# EAGLE design Arduino_bt07 (EAGLE 6.4)
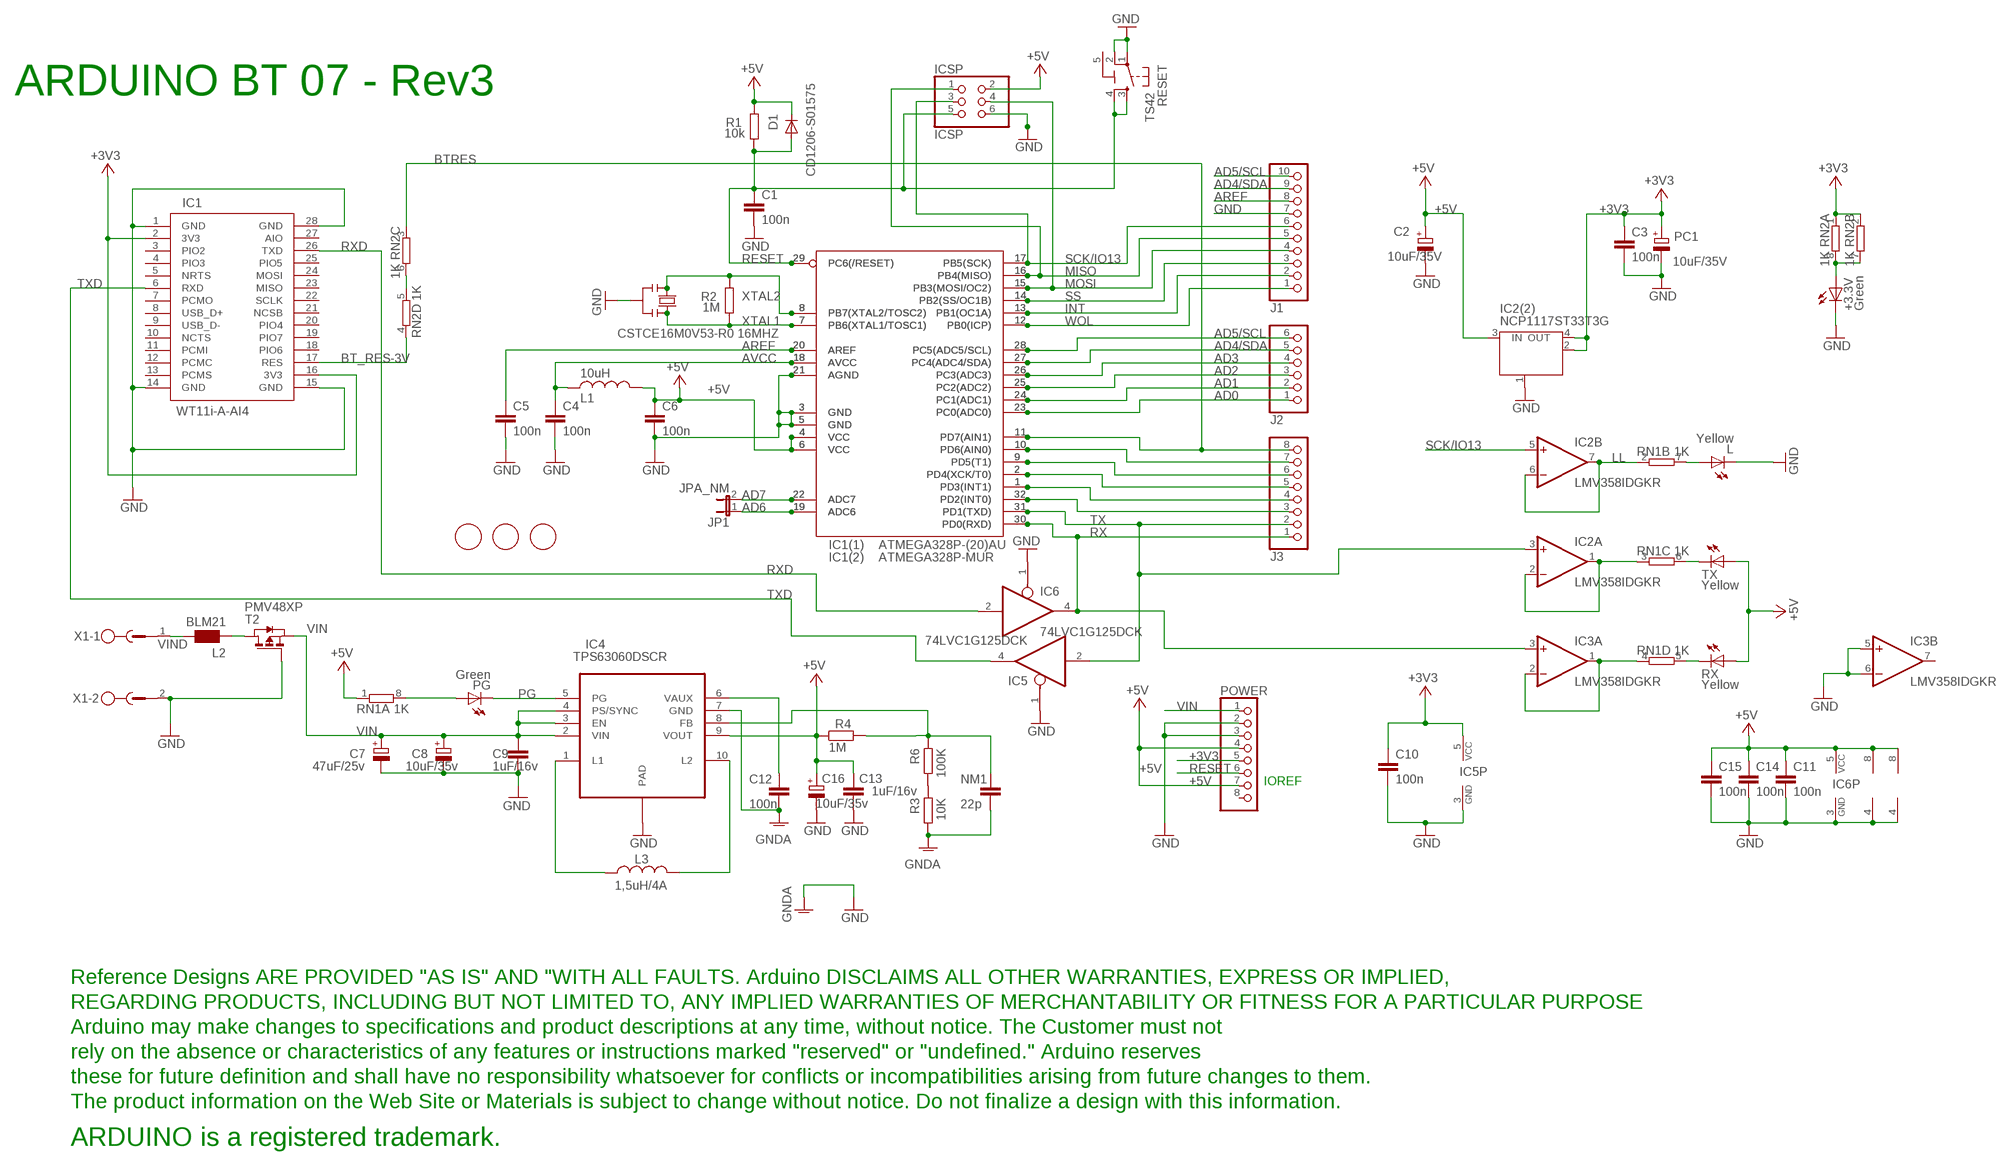
[diagram p0: schematic, sheet 1]

## Parts
+3.3V  Green  LEDCHIPLED_0805  [CHIPLED_0805]
C1  100n  C-EU0603-RND  [C0603-ROUND]
C2  10uF/35V  CPOL-EUSMCB  [SMC_B]
C3  100n  C-EU0603-RND  [C0603-ROUND]
C4  100n  C-EU0603-RND  [C0603-ROUND]
C5  100n  C-EU0603-RND  [C0603-ROUND]
C6  100n  C-EU0603-RND  [C0603-ROUND]
C7  47uF/25v  CPOL-EUD  [PANASONIC_D]
C8  10uF/35v  CPOL-EUSMCB  [SMC_B]
C9  1uF/16v  C-EUC0603  [C0603-ROUND]
C10  100n  C-EU0603-RND  [C0603-ROUND]
C11  100n  C-EU0603-RND  [C0603-ROUND]
C12  100n  C-EUC0603  [C0603-ROUND]
C13  1uF/16v  C-EUC0603  [C0603-ROUND]
C14  100n  C-EU0603-RND  [C0603-ROUND]
C15  100n  C-EU0603-RND  [C0603-ROUND]
C16  10uF/35v  CPOL-EUSMCB  [SMC_B]
D1  CD1206-S01575  DIODE-MINIMELF  [MINIMELF]
IC1  WT11i-A-AI4  WT11  [WT11-A]
IC1(1)  ATMEGA328P-(20)AU  ATMEGAXX8-AU  [TQFP32-08]
IC1(2)  ATMEGA328P-MUR  ATMEGAXX8-MUR  [MLF32]
IC2  LMV358IDGKR  LMV358MM  [MSOP08]
IC2(2)  NCP1117ST33T3G  MC33269ST-3.3T3  [SOT223]
IC3  LMV358IDGKR  LMV358MM  [MSOP08]
IC4  TPS63060DSCR  TPS63060  [R-PVSON-10N]
IC5  74LVC1G125DCK  [SC70-5]
IC6  74LVC1G125DCK  [SC70-5]
ICSP  ICSP  PINHD-2X3  [2X03]
J1  PINHD-1X10TH  [1X10-TH]
J2  PINHD-1X6TH  [1X06-TH]
J3  PINHD-1X8TH  [1X08-TH]
JP1  JPA_NM  JP1E  [JP1]
L  Yellow  LEDCHIPLED_0805  [CHIPLED_0805]
L1  10uH  L-USL2012C  [L2012C]
L2  BLM21  WE-CBF_0805  [0805]
L3  1,5uH/4A  L-USSRR0604  [SRR0604]
NM1  22p  C-EUC0603  [C0603-ROUND]
PC1  10uF/35V  CPOL-EUSMCB  [SMC_B]
PG  Green  LEDCHIPLED_0805  [CHIPLED_0805]
POWER  PINHD-1X8TH  [1X08-TH]
R1  10k  R-EU_0603-RND  [R0603-ROUND]
R2  1M  R-EU_0603-RND  [R0603-ROUND]
R3  10K  R-EU_0603-RND  [R0603-ROUND]
R4  1M  R-EU_0603-RND  [R0603-ROUND]
R6  100K  R-EU_0603-RND  [R0603-ROUND]
RESET  TS42  [TS42]
RN1  1K  4R-NCAY16  [CAY16]
RN2  1K  4R-NCAY16  [CAY16]
RX  Yellow  LEDCHIPLED_0805  [CHIPLED_0805]
T2  PMV48XP  PMOSSOT23  [SOT-23]
TX  Yellow  LEDCHIPLED_0805  [CHIPLED_0805]
U$1  FIDUCIALMOUNT  [FIDUCIA-MOUNT]
U$2  FIDUCIALMOUNT  [FIDUCIA-MOUNT]
U$3  FIDUCIALMOUNT  [FIDUCIA-MOUNT]
U$4  DISCLAIMER  [DISCLAIMER]
X1  MSTBV2  [MSTBV2]
Y1  CSTCE16M0V53-R0 16MHZ  RESONATORMU  [RESONATOR]

## Nets
+3V3 [power]: C3.1 C10.1 IC1.2(3V3) IC1.16(3V3) IC2(2).2(OUT) IC2(2).4(OUT) IC5.5(VCC) PC1.+ POWER.5 RN2.1 RN2.2
+5V [power]: C2.+ C6.1 C11.1 C13.1 C14.1 C15.1 C16.+ D1.C IC1(1).4(VCC) IC1(1).6(VCC) IC1(2).4(VCC) IC1(2).6(VCC) IC2(2).3(IN) IC2.8(P:V+) IC3.8(P:V+) IC4.9(VOUT) IC6.5(VCC) ICSP.2 L1.1 POWER.4 POWER.7 R1.2 R4.1 RN1.1 RX.A TX.A
AD0: IC1(1).23(PC0(ADC0)) IC1(2).23(PC0(ADC0)) J2.1
AD1: IC1(1).24(PC1(ADC1)) IC1(2).24(PC1(ADC1)) J2.2
AD2: IC1(1).25(PC2(ADC2)) IC1(2).25(PC2(ADC2)) J2.3
AD3: IC1(1).26(PC3(ADC3)) IC1(2).26(PC3(ADC3)) J2.4
AD4/SDA: IC1(1).27(PC4(ADC4/SDA)) IC1(2).27(PC4(ADC4/SDA)) J1.9 J2.5
AD5/SCL: IC1(1).28(PC5(ADC5/SCL)) IC1(2).28(PC5(ADC5/SCL)) J1.10 J2.6
AD6: IC1(1).19(ADC6) IC1(2).19(ADC6) JP1.1
AD7: IC1(1).22(ADC7) IC1(2).22(ADC7) JP1.2
AREF [power]: C5.1 IC1(1).20(AREF) IC1(2).20(AREF) J1.8
AVCC [power]: C4.1 IC1(1).18(AVCC) IC1(2).18(AVCC) L1.2
BT_RES-3V: IC1.17(RES) RN2.4
BTRES: IC1(1).11(PD7(AIN1)) IC1(2).11(PD7(AIN1)) J3.8 RN2.3
GND [gnd]: +3.3V.C C1.2 C2.- C3.2 C4.2 C5.2 C6.2 C7.- C8.- C9.2 C10.2 C11.2 C13.2 C14.2 C15.2 C16.- IC1(1).3(GND) IC1(1).5(GND) IC1(1).21(AGND) IC1(2).3(GND) IC1(2).5(GND) IC1(2).21(AGND) IC1.1(GND) IC1.14(GND) IC1.15(GND) IC1.28(GND) IC2(2).1(GND/ADJ) IC2.4(P:V-) IC3.4(P:V-) IC3.5(B:+IN) IC3.6(B:-IN) IC4.PAD IC5.1(OE) IC5.3(GND) IC6.1(OE) IC6.3(GND) ICSP.6 J1.7 L.C PC1.- POWER.2 POWER.3 RESET.1 RESET.2 T2.3(G) X1.2 Y1.2
GNDA [gnd]: C12.2 IC4.7(GND) NM1.2 R3.2 ; supply symbol labelled GND
INT: IC1(1).13(PB1(OC1A)) IC1(2).13(PB1(OC1A)) J1.2
LL: IC2.6(B:-IN) IC2.7(B:OUT) RN1.2
MISO: IC1(1).16(PB4(MISO)) IC1(2).16(PB4(MISO)) ICSP.1 J1.5
MOSI: IC1(1).15(PB3(MOSI/OC2)) IC1(2).15(PB3(MOSI/OC2)) ICSP.4 J1.4
N$1: R3.1 R6.2
N$2: L.A RN1.7
N$3: RN1.6 TX.C
N$4: RN1.5 RX.C
N$5: +3.3V.A RN2.7 RN2.8
N$6: IC2.1(A:OUT) IC2.2(A:-IN) RN1.3
N$7: PG.A RN1.8
N$8: IC3.1(A:OUT) IC3.2(A:-IN) RN1.4
N$9: L2.1 T2.1(D)
N$11: IC1(1).1(PD3(INT1)) IC1(2).1(PD3(INT1)) J3.4
N$12: IC1(1).2(PD4(XCK/T0)) IC1(2).2(PD4(XCK/T0)) J3.5
N$13: IC1(1).9(PD5(T1)) IC1(2).9(PD5(T1)) J3.6
N$14: IC1(1).10(PD6(AIN0)) IC1(2).10(PD6(AIN0)) J3.7
N$15: IC4.10(L2) L3.P$2
N$16: RN2.5 RN2.6
N$17: IC1(1).32(PD2(INT0)) IC1(2).32(PD2(INT0)) J3.3
N$35: C12.1 IC4.6(VAUX)
N$39: IC4.8(FB) NM1.1 R4.2 R6.1
N$47: IC4.1(L1) L3.P$1
PG [power]: IC4.5(PG) PG.C
RESET: C1.1 D1.A IC1(1).29(PC6(/RESET)) IC1(2).29(PC6(/RESET)) ICSP.5 POWER.6 R1.1 RESET.3 RESET.4
RX: IC1(1).30(PD0(RXD)) IC1(2).30(PD0(RXD)) IC3.3(A:+IN) IC6.4(O) J3.1
RXD: IC1.26(TXD) IC6.2(I)
SCK/IO13: IC1(1).17(PB5(SCK)) IC1(2).17(PB5(SCK)) IC2.5(B:+IN) ICSP.3 J1.6
SS: IC1(1).14(PB2(SS/OC1B)) IC1(2).14(PB2(SS/OC1B)) J1.3
TX: IC1(1).31(PD1(TXD)) IC1(2).31(PD1(TXD)) IC2.3(A:+IN) IC5.2(I) J3.2
TXD: IC1.6(RXD) IC5.4(O)
VIN [power]: C7.+ C8.+ C9.1 IC4.2(VIN) IC4.3(EN) IC4.4(PS/SYNC) POWER.1 T2.2(S)
VIND [power]: L2.2 X1.1
WOL: IC1(1).12(PB0(ICP)) IC1(2).12(PB0(ICP)) J1.1
XTAL1: IC1(1).7(PB6(XTAL1/TOSC1)) IC1(2).7(PB6(XTAL1/TOSC1)) R2.1 Y1.3
XTAL2: IC1(1).8(PB7(XTAL2/TOSC2)) IC1(2).8(PB7(XTAL2/TOSC2)) R2.2 Y1.1
Unconnected: IC1.3(PIO2) IC1.4(PIO3) IC1.5(NRTS) IC1.7(PCMO) IC1.8(USB_D+) IC1.9(USB_D-) IC1.10(NCTS) IC1.11(PCMI) IC1.12(PCMC) IC1.13(PCMS) IC1.18(PIO6) IC1.19(PIO7) IC1.20(PIO4) IC1.21(NCSB) IC1.22(SCLK) IC1.23(MISO) IC1.24(MOSI) IC1.25(PIO5) IC1.27(AIO) IC3.7(B:OUT) POWER.8

## Notes on the sheet
- ARDUINO BT 07 - Rev3
- IOREF

## Power pins joined to a net without a drawn wire
5-GND: RESET.5(5-GND)

## Library data of the parts
+3.3V L PG RX TX = led:LED: LED OSRAM: - CHIPLED LG R971, LG N971, LY N971, LG Q971, LY Q971, LO R971, LY R971 LH N974, LH R974 LS Q976, LO Q976, LY Q976 LO Q996 - Hyper CHIPLED LW Q18S LB Q993, LB Q99A, LB R99A - SideLED LS A670, LO A670, LY A670, LG A670, LP A670 LB A673, LV A673, LT A673, LW A673 LH A674 LY A675 LS A676, LA A676, LO A676, LY A676, LW A676 LS A679, LY A679, LG A679 - Hyper Micro SIDELED® LS Y876, LA Y876, LO Y876, LY Y876 LT Y87S - SmartLED LW L88C, LW L88S LB L89C, LB L89S, LG L890 LS L89K, LO L89K, LY L89K LS L896, LA L896, LO L896, LY L896 - TOPLED LS T670, LO T670, LY T670, LG T670, LP T670 LSG T670, LSP T670, LSY T670, LOP T670, LYG T670 LG T671, LOG T671, LSG T671 LB T673, LV T673, LT T673, LW T673 LH T674 LS T676, LA T676, LO T676, LY T676, LB T676, LH T676, LSB T676, LW T676 LB T67C, LV T67C, LT T67C, LS T67K, LO T67K, LY T67K, LW E67C LS E67B, LA E67B, LO E67B, LY E67B, LB E67C, LV E67C, LT E67C LW T67C LS T679, LY T679, LG T679 LS T770, LO T770, LY T770, LG T770, LP T770 LB T773, LV T773, LT T773, LW T773 LH T774 LS E675, LA E675, LY E675, LS T675 LS T776, LA T776, LO T776, LY T776, LB T776 LHGB T686 LT T68C, LB T68C - Hyper Mini TOPLED® LB M676 - Mini TOPLED Santana® LG M470 LS M47K, LO M47K, LY M47K Source: http://www.osram.convergy.de - LUMILED® LXK2-PW12-R00, LXK2-PW12-S00, LXK2-PW14-U00, LXK2-PW14-V00 LXK2-PM12-R00, LXK2-PM12-S00, LXK2-PM14-U00 LXK2-PE12-Q00, LXK2-PE12-R00, LXK2-PE12-S00, LXK2-PE14-T00, LXK2-PE14-U00 LXK2-PB12-K00, LXK2-PB12-L00, LXK2-PB12-M00, LXK2-PB14-N00, LXK2-PB14-P00, LXK2-PB14-Q00 LXK2-PR12-L00, LXK2-PR12-M00, LXK2-PR14-Q00, LXK2-PR14-R00 LXK2-PD12-Q00, LXK2-PD12-R00, LXK2-PD12-S00 LXK2-PH12-R00, LXK2-PH12-S00 LXK2-PL12-P00, LXK2-PL12-Q00, LXK2-PL12-R00 Source: www.luxeon.com
C1 C3-C6 C9-C15 NM1 = SmartPrj:C-EU: CAPACITOR, European symbol
C2 C7 C8 C16 = SmartPrj:CPOL-EU: POLARIZED CAPACITOR, European symbol
D1 = diode:DIODE-: DIODE
IC1 = idii:WT11
IC1(1) IC1(2) = SmartPrj:ATMEGAXX8: MICROCONTROLLER 8 Kbytes FLASH 1 kbytes SRAM 512 bytes EEPROM USART 6-channel 10 bit ADC 2-channel 8 bit ADC Source: avr.lbr
IC2 IC3 = linear:LMV358?*: Dual General Purpose, Low Voltage, Rail-to-Rail Output Operational Amplifiers Source: http://www.national.com/mpf/LM/LMV321.html http://www.national.com/dt/lmv_qual.pdf
IC2(2) = linear:MC33269ST*: Adjustable Output Low Dropout Voltage Regulator 800 mA Source: http://www.onsemi.com/pub/Collateral/MC33269-D.PDF
IC4 = SmartPrj:TPS63060: TPS63060 Single Inductor Buck-Boost Converter 2A Switches
IC5 IC6 = 74xx-little-us:74*1G125: Single Bus Buffer Gate with 3-State Output
ICSP = SmartPrj:PINHD-2X3: PIN HEADER
J1 = SmartPrj:PINHD-1X10: PIN HEADER
J2 = SmartPrj:PINHD-1X6: PIN HEADER
J3 POWER = SmartPrj:PINHD-1X8: PIN HEADER
JP1 = jumper:JP1E: JUMPER
L1 L3 = SmartPrj:L-US: INDUCTOR, American symbol
L2 = wuerth-elektronik:WE-CBF: SMD EMI Suppression Ferrite Beads - excellent anti-EMI properties - low DCR - impedances till 3000 ohms - rated current up to 6 A
PC1 = rcl:CPOL-EU: POLARIZED CAPACITOR, European symbol
R1-R4 R6 = SmartPrj:R-EU_: RESISTOR, European symbol
RESET = SmartPrj:TS42: TS42 Dongnan Electronics Tact switch VDC 12V - 50mA
RN1 RN2 = resistor-dil:4R-N: Array Chip Resistor Source: RS Component / Phycomp
T2 = zetex:PMOSSOT23: MOS FET
U$1-U$3 = SmartPrj:FIDUCIALMOUNT
U$4 = SmartPrj:DISCLAIMER
X1 = con-phoenix-500:MSTBV2: PHOENIX
Y1 = SmartPrj:RESONATOR

## Net classes
0 default: width 0.254 mm, drill 0.584 mm, clearance 0.203 mm
1 power: width 0.254 mm, drill 0.584 mm, clearance 0.203 mm
2 gnd: width 0.254 mm, drill 0.584 mm, clearance 0.203 mm
5 +5v: width 0.406 mm, drill 0.787 mm, clearance 0.203 mm

## Board
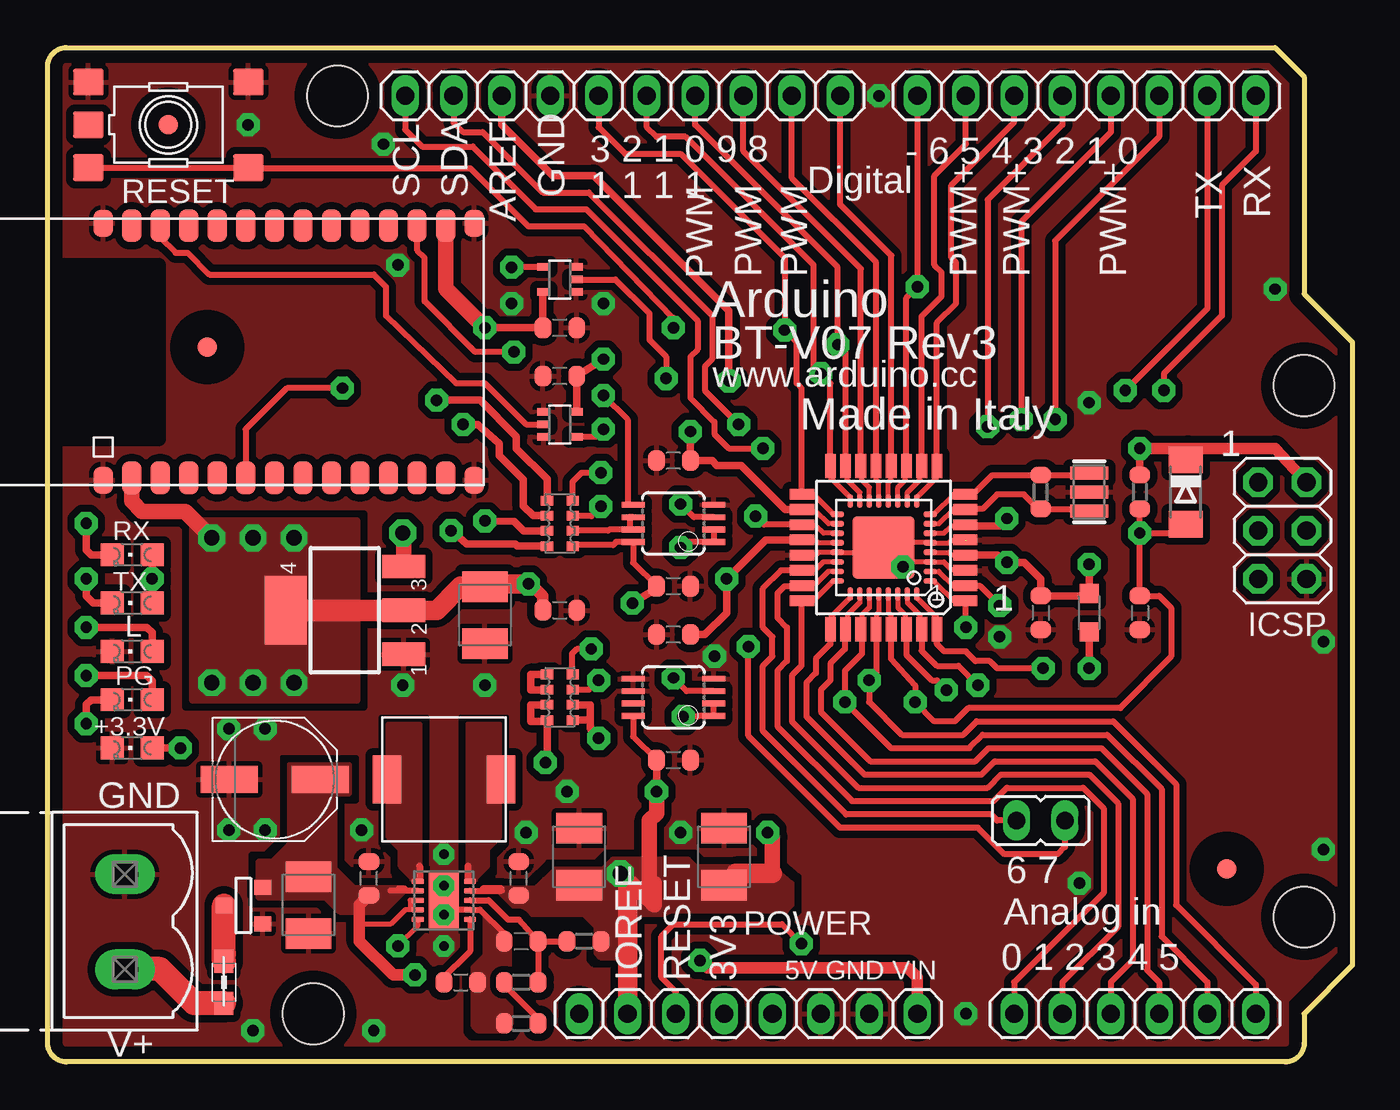
[diagram p1: board, top side]
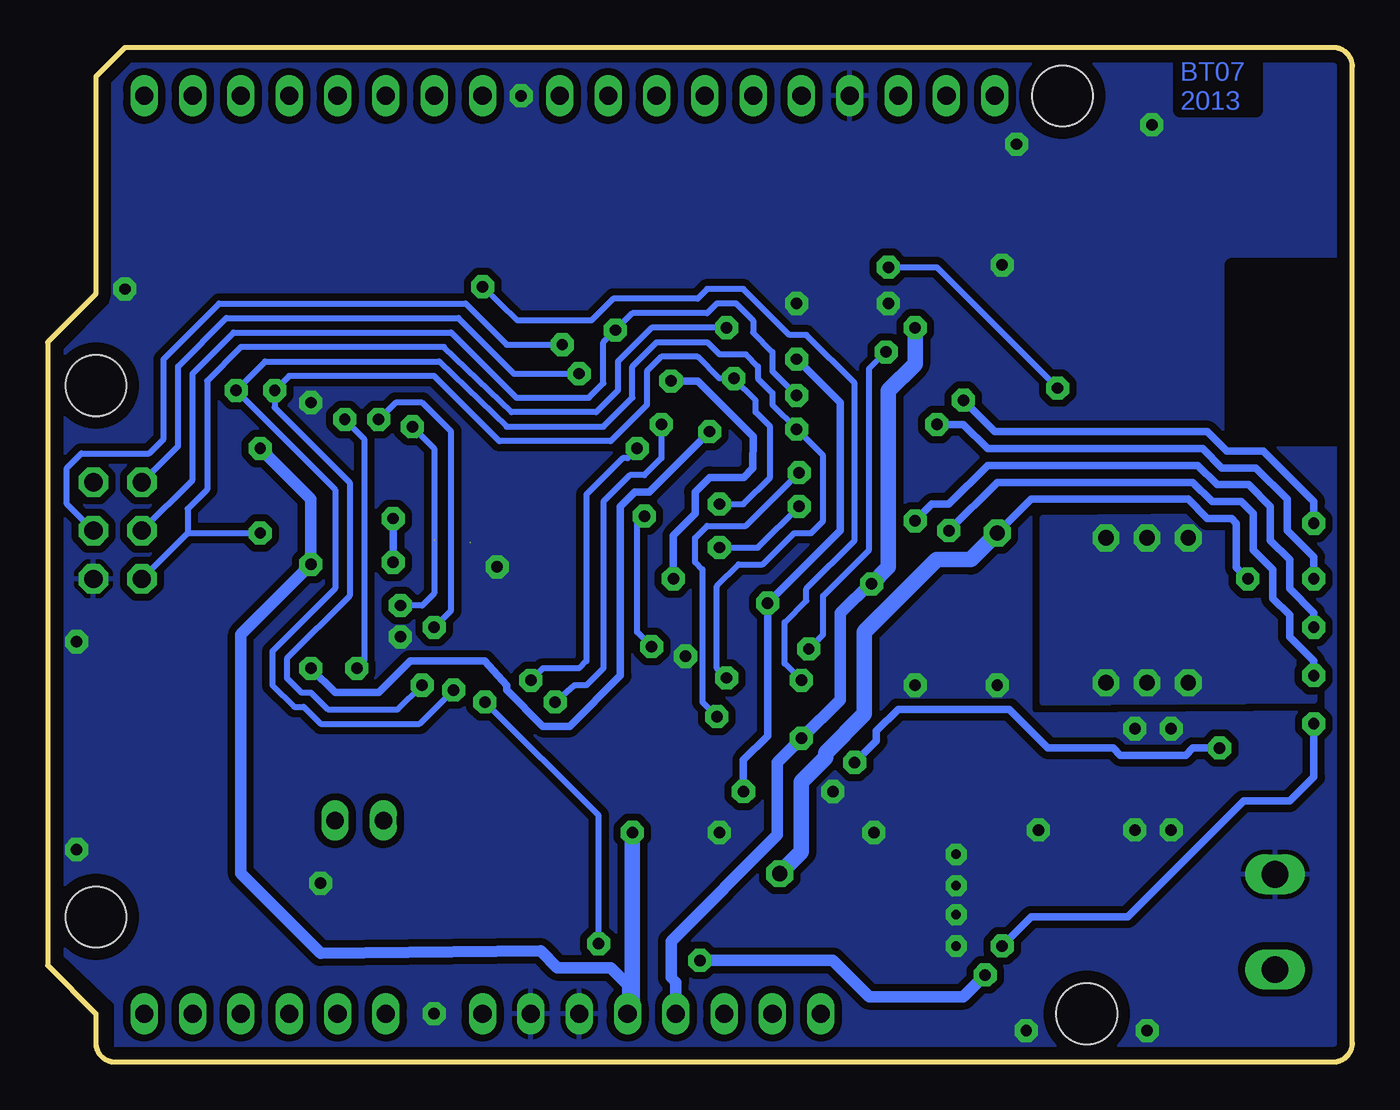
[diagram p2: board, bottom side, seen from below]

Size 68.58 x 53.34 mm. Coordinates in mm from the lower left corner, seen from the top.
Outline: 65.04,0 1,0 arc-90 0,1 0,52.34 arc-90 1,53.34 64.52,53.34 66.04,51.82 66.04,40.39 68.58,37.85 68.58,5.08 66.04,2.54 66.04,1 arc-90 65.04,0
Copper layers (1*16): Top 0.035mm / dielectric 1.5mm / Bottom 0.035mm
Design rules "default": minimum track width 8mil, minimum drill 15mil, track to track 8mil, track to pad 8mil, pad to pad 8mil, via to via 12mil, smd to smd 8mil, copper to edge 26mil, drill to drill 12mil, minimum pad ring 10mil, minimum via ring 12mil, stop-mask expansion 2mil, vias tented up to drill 31mil, thermal gap 10mil
Holes 3.2 mm at 66.04,35.56 66.04,7.62 15.24,50.8 13.97,2.54
tRestrict: area 0.5,32.8 to 5.8,41.9
bRestrict: area 1,32.8 to 6.3,41.9

### Footprints (pad centres in the part's own frame; a part is rotated, then mirrored left to right if it is on the bottom)
CHIPLED_0805 = smd 1.2 x 1.2: A 0,-1.05; C 0,1.05
C0603-ROUND = smd 0.898 x 1.1: 1 -0.889,0; 2 0.889,0
SMC_B = smd 1.6 x 2.4: + -1.5,0; - 1.5,0
PANASONIC_D = smd 3 x 1.4: + 2.4,0; - -2.4,0
MINIMELF = smd 1.4 x 1.8: A 1.7,0; C -1.7,0
WT11-A = smd 1.4 x 1: 1 -0.75,0; 14 -0.75,19.5; 15 -14.25,19.5; 28 -14.25,0 | smd 1.7 x 1: 2 -0.875,1.5; 3 -0.875,3; 4 -0.875,4.5; 5 -0.875,6; 6 -0.875,7.5; 7 -0.875,9; 8 -0.875,10.5; 9 -0.875,12; 10 -0.875,13.5; 11 -0.875,15; 12 -0.875,16.5; 13 -0.875,18; 16 -14.125,18; 17 -14.125,16.5; 18 -14.125,15; 19 -14.125,13.5; 20 -14.125,12; 21 -14.125,10.5; 22 -14.125,9; 23 -14.125,7.5; 24 -14.125,6; 25 -14.125,4.5; 26 -14.125,3; 27 -14.125,1.5
TQFP32-08 = smd 1.27 x 0.559: 1 -4.293,2.8; 2 -4.293,2; 3 -4.293,1.2; 4 -4.293,0.4; 5 -4.293,-0.4; 6 -4.293,-1.2; 7 -4.293,-2; 8 -4.293,-2.8; 17 4.293,-2.8; 18 4.293,-2; 19 4.293,-1.2; 20 4.293,-0.4; 21 4.293,0.4; 22 4.293,1.2; 23 4.293,2; 24 4.293,2.8 | smd 0.559 x 1.27: 9 -2.8,-4.293; 10 -2,-4.293; 11 -1.2,-4.293; 12 -0.4,-4.293; 13 0.4,-4.293; 14 1.2,-4.293; 15 2,-4.293; 16 2.8,-4.293; 25 2.8,4.293; 26 2,4.293; 27 1.2,4.293; 28 0.4,4.293; 29 -0.4,4.293; 30 -1.2,4.293; 31 -2,4.293; 32 -2.8,4.293
MLF32 = smd 0.7 x 0.28: 1 -2.45,1.75; 2 -2.45,1.25; 3 -2.45,0.75; 4 -2.45,0.25; 5 -2.45,-0.25; 6 -2.45,-0.75; 7 -2.45,-1.25; 8 -2.45,-1.75; 17 2.45,-1.75; 18 2.45,-1.25; 19 2.45,-0.75; 20 2.45,-0.25; 21 2.45,0.25; 22 2.45,0.75; 23 2.45,1.25; 24 2.45,1.75 | smd 0.28 x 0.7: 9 -1.75,-2.45; 10 -1.25,-2.45; 11 -0.75,-2.45; 12 -0.25,-2.45; 13 0.25,-2.45; 14 0.75,-2.45; 15 1.25,-2.45; 16 1.75,-2.45; 25 1.75,2.45; 26 1.25,2.45; 27 0.75,2.45; 28 0.25,2.45; 29 -0.25,2.45; 30 -0.75,2.45; 31 -1.25,2.45; 32 -1.75,2.45 | smd 3.254 x 3.254: 33 0,0
MSOP08 = smd 0.3 x 1.2: 1 -0.976,-2.113; 2 -0.326,-2.113; 3 0.324,-2.113; 4 0.974,-2.113; 5 0.974,2.112; 6 0.324,2.112; 7 -0.326,2.112; 8 -0.976,2.112
SOT223 = smd 1.219 x 2.235: 1 -2.311,-3.099; 2 0,-3.099; 3 2.311,-3.099 | smd 3.6 x 2.2: 4 0,3.099
R-PVSON-10N = smd 0.3 x 0.65: 1 -1,-1.375; 2 -0.5,-1.375; 3 0,-1.375; 4 0.5,-1.375; 5 1,-1.375; 6 1,1.375; 7 0.5,1.375; 8 0,1.375; 9 -0.5,1.375; 10 -1,1.375 | smd 3 x 1.6: PAD 0,0
SC70-5 = smd 0.4 x 0.7: 1 -0.65,-0.85; 2 0,-0.85; 3 0.65,-0.85; 4 0.65,0.85; 5 -0.65,0.85
2X03 = drill 0.95 pad 1.55 octagon: 1 -2.54,-1.27; 2 -2.54,1.27; 3 0,-1.27; 4 0,1.27; 5 2.54,-1.27; 6 2.54,1.27
1X10-TH = drill 0.95 pad 1.422 long: 1 -11.43,0; 2 -8.89,0; 3 -6.35,0; 4 -3.81,0; 5 -1.27,0; 6 1.27,0; 7 3.81,0; 8 6.35,0; 9 8.89,0; 10 11.43,0
1X06-TH = drill 0.95 pad 1.422 long: 1 -6.35,0; 2 -3.81,0; 3 -1.27,0; 4 1.27,0; 5 3.81,0; 6 6.35,0
1X08-TH = drill 0.95 pad 1.422 long: 1 -8.89,0; 2 -6.35,0; 3 -3.81,0; 4 -1.27,0; 5 1.27,0; 6 3.81,0; 7 6.35,0; 8 8.89,0
JP1 = drill 0.914 long: 1 0,-1.27; 2 0,1.27
L2012C = smd 1 x 1: 1 -1,0; 2 1,0
0805 = smd 1.2 x 1: 1 -1.1,0; 2 1.1,0
SRR0604 = smd 1.5 x 2.5: P$1 3,0; P$2 -3,0
R0603-ROUND = smd 0.898 x 1.1: 1 -0.889,0; 2 0.889,0
TS42 = smd 1.6 x 1.4: 1 -4.2,2.25; 2 4.2,2.25; 3 -4.2,-2.25; 4 4.2,-2.25; 5 -4.2,0
CAY16 = smd 0.5 x 0.65: 1 -1.2,-0.675; 2 -0.4,-0.675; 3 0.4,-0.675; 4 1.2,-0.675; 5 1.2,0.675; 6 0.4,0.675; 7 -0.4,0.675; 8 -1.2,0.675
SOT-23 = smd 0.787 x 0.889: 1 0.025,-1.016; 2 -0.94,1.016; 3 0.991,1.016
FIDUCIA-MOUNT = smd 1.016 x 1.016: P$1 0,0
MSTBV2 = drill 1.397 long: 1 -2.5,0; 2 2.5,0
RESONATOR = smd 0.7 x 2: 1 -1,0; 2 0,0; 3 1,0

### Placement (x,y rotation side)
+3.3V  4.45,16.51 90 top
C1  57.4,23.62 270 top
C2  27.94,10.79 90 top
C3  26.92,23.75 0 top
C4  32.89,31.62 180 top
C5  32.89,22.48 180 top
C6  52.2,23.62 270 top
C7  11.94,14.86 0 top
C8  13.72,8.26 270 top
C9  16.89,9.65 90 top
C10  26.92,38.61 0 top
C11  26.92,36.07 180 top
C12  21.72,4.19 0 top
C13  24.77,9.65 90 top
C14  32.89,15.88 0 top
C15  32.89,25.02 0 top
C16  35.56,10.79 90 top
D1  59.82,29.97 270 top
IC1  2.92,29.84 270 top
IC1(1)  43.94,27.05 180 top
IC1(2)  43.94,27.05 180 top
IC2  32.89,28.32 90 top
IC2(2)  15.62,23.75 90 top
IC3  32.89,19.18 90 top
IC4  20.83,8.51 270 top
IC5  26.92,41.15 90 top
IC6  26.92,33.53 270 top
ICSP  64.9,27.94 270 top
J1  30.23,50.8 180 top
J2  57.15,2.54 0 top
J3  54.61,50.8 180 top
JP1  52.2,12.7 90 top
L  4.45,21.59 90 top
L1  54.74,23.62 270 top
L2  9.27,4.19 270 top
L3  20.83,14.86 180 top
NM1  24.89,6.35 180 top
PC1  22.99,23.5 270 top
PG  4.45,19.05 90 top
POWER  36.83,2.54 180 top
R1  57.4,29.97 90 top
R2  52.2,29.97 90 top
R3  24.89,2.03 180 top
R4  28.19,6.35 180 top
R6  24.89,4.19 180 top
RESET  6.35,49.28 0 top
RN1  26.92,28.32 90 top
RN2  26.92,19.18 90 top
RX  4.45,26.67 90 top
T2  10.29,8.26 270 top
TX  4.45,24.13 90 top
U$1  6.35,49.28 0 top
U$2  8.38,37.59 0 top
U$3  61.98,10.16 0 top
U$4  -12.06,-22.99 0 top  (outside the outline)
X1  4.06,7.37 90 top
Y1  54.74,29.97 270 top

### Tracks (layer width: path | path; a pad name or v marks a point on that pad's centre or on a via)
+3V3  (via drill 0.6, 0.8)
  Top 0.406: 25.17,25.12 v25.27,25.15 | IC5.5 26.04,40.46 C10.1 v22.99,38.61 | RN2.2 28.52,18.78 28.52,17.98 | v28.96,17.02 28.57,17.4 28.52,17.53 28.52,17.98 | RN2.1 28.52,17.98
  Top 0.61: 25.17,25.12 25.3,25.25 26.04,24.51 C3.1
  Top 0.813: IC1.2 4.42,29.49 4.95,28.96 7.24,28.96 v8.64,27.56 | IC1.16 20.92,40.67 v22.99,38.61
  Top 1.016: 25.17,25.12 23.01,25.12 22.99,25.15 PC1.+ 22.96,25.02 21.72,25.02 20.45,23.75 IC2(2).2
  Top 1.143: IC2(2).2 IC2(2).4
  Bottom 0.406: v25.27,25.15 25.27,25.25
  Bottom 0.61: 25.27,25.25 26.92,23.6 26.92,19.05 v28.96,17.02 30.23,15.75 30.23,11.94 35.81,6.35 35.81,4.45 35.56,4.19 POWER.5
  Bottom 0.813: v22.99,38.61 22.99,36.7 24.38,35.31 24.38,26.04 v25.27,25.15
  other vias: 12.95,27.56 10.79,27.56 12.95,19.94 10.79,19.94 8.64,19.94
  pour Top (isolate 0.406, no thermals): 16.26,28.45 16.26,19.05 7.62,19.05 7.62,28.45
  pour Bottom (isolate 0.406, no thermals): 16.26,28.57 16.26,18.92 2.03,19.05 2.03,28.7
+5V  (via drill 0.6, 0.8)
  Top 0.254: IC1(2).4 47.37,26.8 47.5,26.67 48.22,26.67 IC1(1).4 | IC1(2).6 47.1,27.8 47.5,28.19 48.01,28.19 48.18,28.19 IC1(1).6 | 23.88,9.14 22.86,9.14
  Top 0.305: RN1.1 27.66,27.18 29.72,27.18 29.89,27.34 IC2.8 30.78,26.24 C15.1 | IC3.8 30.78,17.1 C14.1 | IC4.9 23.87,9.01 23.88,9.02
  Top 0.406: IC1(1).4 49.91,26.67 50.31,26.27 v50.42,26.27 51.33,26.27 52.2,25.4 C6.1 54.63,24.51 L1.1 v54.74,26.16 | RX.A v5.5,25.4 TX.A | v32,14.22 C14.1 | C15.1 32,24.89 v30.73,24.13 | v57.4,32.26 R1.2 | D1.C 59.94,32.26 | IC6.5 27.81,34.22 C11.1 v29.21,36.96 | v50.42,28.57 50.04,28.19 48.01,28.19
  Top 0.61: v57.4,32.26 59.94,32.26 64.52,32.26 ICSP.2
  Top 0.813: 31.62,9.53 31.62,12.7 32,13.08 v32,14.22 | 30.48,9.27 30.61,9.4 | IC2(2).3 18.72,27.76 v18.67,27.81 | v30.1,9.91 31.75,8.38 31.88,8.26 31.88,9.4 | 38.1,9.91 38.1,11.81 v37.85,12.06
  Top 1.016: POWER.7 30.48,9.27 | 38.1,9.91 36.17,9.91
  Bottom 0.406: v32,14.22 C14.1 30.73,17.14 v30.73,24.13 26.92,27.94 26.92,34.67 v29.21,36.96 | v18.67,27.81 16.89,29.59 8.64,29.59 7.62,28.57 6.35,28.57 6.1,28.32 6.1,26 v5.5,25.4 | v50.42,28.57 v50.42,26.27
  Bottom 0.61: v57.4,32.26 54.74,29.59 v54.74,26.16 58.42,22.48 58.42,9.91 54.23,5.71 42.67,5.84 41.78,4.95 38.99,4.95 38.1,4.06 POWER.4
  Bottom 0.813: v18.67,27.81 20.07,26.42 21.84,26.42 25.65,22.61 25.65,18.29 27.69,16.26 27.69,16 28.96,14.73 28.96,11.05 v30.1,9.91 | v37.85,12.06 37.85,2.79 POWER.4
  pour Top (isolate 0.406, no thermals): 21.84,9.14 25.65,9.14 26.67,10.16 29.21,10.16 29.72,10.67 33.66,10.67 34.04,10.29 38.1,10.29 39.12,9.4 39.12,8.26 38.61,7.75 30.86,7.75 30.86,5.46 29.08,5.46 28.83,5.71 28.83,7.11 28.19,7.75 24.51,7.75 23.24,9.02 21.97,9.02
AD0
  Top 0.254: IC1(2).23 41.04,25.8 40.39,25.15 39.74,25.15 IC1(1).23
  Top 0.305: J2.1 50.8,4.19 55.5,8.89 55.5,13.34 54.42,14.41 50.42,14.41 49.72,13.72 42.29,13.72 38.35,17.65 38.35,20.57 38.86,21.08 38.86,22.86 38.35,23.37 38.35,24.64 38.73,25.02 39.62,25.02 IC1(1).23
AD1
  Top 0.254: IC1(2).24 41.3,25.3 40.26,24.26 IC1(1).24
  Top 0.305: J2.2 53.34,4.19 56.26,7.11 56.26,13.59 54.74,15.11 50.1,15.11 49.4,14.41 42.61,14.41 39.12,17.91 39.12,20.32 39.62,20.83 39.62,24.26 40.26,24.26
AD2
  Top 0.254: IC1(2).25 42.19,24.41 41.15,23.37 IC1(1).25
  Top 0.305: IC1(1).25 41.15,21.97 40.39,21.21 40.39,20.45 39.88,19.94 39.88,18.16 42.93,15.11 49.09,15.11 49.78,15.81 55.05,15.81 57.02,13.84 57.02,5.33 55.88,4.19 J2.3
AD3
  Top 0.254: IC1(2).26 42.69,24.15 42.04,23.5 42.04,23.11 41.91,22.99 41.91,22.85 IC1(1).26
  Top 0.305: 41.91,22.85 41.91,21.72 41.15,20.95 41.15,20.07 40.64,19.56 40.64,18.41 43.24,15.81 48.77,15.81 49.47,16.51 55.37,16.51 57.78,14.1 57.78,4.83 58.42,4.19 J2.4
AD4/SDA  (via drill 0.6)
  Top 0.254: IC1(2).27 43.19,23.89 42.8,23.5 42.8,22.82 IC1(1).27
  Top 0.305: 42.8,22.82 42.8,21.46 41.91,20.57 v41.91,18.92 44.32,16.51 48.45,16.51 49.15,17.21 55.69,17.21 58.55,14.35 58.55,6.6 60.96,4.19 J2.5 | J1.9 21.34,49.4 21.84,48.9 22.86,48.9 26.04,45.72 28.45,45.72 34.92,39.24 34.92,36.96 34.54,36.58 34.54,35.31 v36.32,33.53
  Bottom 0.305: v36.32,33.53 36.32,31.75 37.21,30.86 37.97,30.86 39.37,29.46 39.37,20.7 40.26,19.81 40.89,19.81 v41.91,18.92
AD5/SCL  (via drill 0.6)
  Top 0.254: IC1(2).28 43.69,23.63 43.56,23.5 43.56,22.78 IC1(1).28
  Top 0.305: 43.56,22.78 43.56,20.45 v43.18,20.07 43.18,18.92 44.9,17.21 48.13,17.21 48.83,17.91 56.01,17.91 59.31,14.61 59.31,8.26 63.5,4.06 J2.6 | J1.10 18.8,49.02 19.68,48.13 22.35,48.13 25.65,44.83 28.32,44.83 34.16,38.99 34.16,37.47 33.78,37.08 33.78,34.92 35.05,33.66 35.05,33.02 35.81,32.26 v37.59,32.26
  Bottom 0.305: v37.59,32.26 38.1,31.75 38.35,31.75 40.26,29.84 40.26,21.08 40.64,20.7 42.55,20.7 v43.18,20.07
AD6  (via drill 0.6)
  Top 0.254: IC1(2).19 40.78,27.8 40.39,28.19 39.71,28.19 IC1(1).19
  Top 0.305: JP1.1 53.47,11.3 53.09,10.92 50.29,10.92 48.9,12.32 41.66,12.32 36.83,17.14 v36.83,21.84 | v37.21,28.7 37.66,28.25 IC1(1).19
  Bottom 0.305: v36.83,21.84 37.59,22.61 37.59,28.32 v37.21,28.7
AD7
  Top 0.254: IC1(2).22 40.78,26.3 40.39,25.91 39.71,25.91 IC1(1).22
  Top 0.305: JP1.2 49.91,12.7 49.59,13.02 41.97,13.02 37.59,17.4 37.59,20.83 38.1,21.34 38.1,22.35 37.59,22.86 37.59,24.89 38.55,25.85 IC1(1).22
AGND
  Top 0.305: 22.07,8.01 21.23,8.01
AREF  (via drill 0.6)
  Top 0.254: IC1(2).20 40.52,27.3 40.39,27.43 39.67,27.43 IC1(1).20
  Top 0.406: C5.1 34.54,22.48 35.69,23.62 v35.69,25.4 37.74,27.45 IC1(1).20 | J1.8 23.88,49.28 26.54,46.61 28.7,46.61 35.81,39.5 v35.81,35.81
  Bottom 0.406: v35.69,25.4 35.69,27.69 34.54,28.83 34.54,29.97 33.78,30.73 32,30.73 31.51,31.22 31.5,32.89 34.42,35.81 v35.81,35.81
AVCC  (via drill 0.6)
  Top 0.254: IC1(2).18 41.04,28.3 40.39,28.96 39.74,28.96 IC1(1).18
  Top 0.406: IC1(1).18 38.77,29.05 36.45,31.37 35.18,31.37 34.92,31.62 C4.1 v33.78,33.15 | L1.2 v54.74,20.7
  Bottom 0.406: v54.74,20.7 53.47,19.43 51.18,19.43 49.53,21.08 45.59,21.08 44.45,19.81 44.45,19.56 42.55,17.65 41.15,17.65 38.48,20.32 38.48,29.21 37.72,29.97 36.96,29.97 v33.78,33.15
BT_RES-3V  (via drill 0.6)
  Top 0.305: v28.57,21.72 27.81,21.72 27.56,21.46 27.56,20.42 RN2.4 | v24.51,37.34 22.48,37.34 19.81,40.01 19.81,42.29 19.43,42.67 19.43,43.96 IC1.17
  Bottom 0.305: v28.57,21.72 27.81,22.48 27.81,24.51 25.4,26.92 25.4,36.45 v24.51,37.34
BTRES  (via drill 0.6)
  Top 0.254: IC1(2).11 44.69,30.21 45.09,30.61 45.09,31.29 IC1(1).11
  Top 0.305: IC1(1).11 45.14,40.19 v45.72,40.77 J3.8 | RN2.3 28.47,19.58 v28.96,20.07
  Bottom 0.305: v28.96,20.07 29.84,20.95 29.84,23.11 28.7,24.26 28.7,24.89 26.16,27.43 26.16,35.69 28.7,38.23 29.59,38.23 32,40.64 33.91,40.64 34.42,40.13 38.86,40.13 40.01,38.99 43.87,38.99 v45.72,40.77
GND  (via drill 0.5, 0.6)  (2 unrouted)
  Top 0.254: IC1(1).3 48.18,25.91 47.5,25.91 47.1,26.3 IC1(2).3 44.97,26.3 v44.96,26.04 | 48.26,27.43 47.5,27.43 47.37,27.3 IC1(2).5 | IC1(2).21 40.52,26.8 40.39,26.67 39.67,26.67 IC1(1).21 | 46.35,27.3 45.47,27.3
  other vias: 20.83,9.27 20.83,7.75 20.83,6.1 20.83,10.92 25.15,12.06 27.3,14.22 33.27,12.06 16.51,12.19 11.43,12.19 9.53,12.19 11.43,17.53 9.53,17.53 17.14,1.65 10.79,1.65 48.26,2.54 43.69,50.8 10.54,49.28 17.65,48.26 18.67,19.81 22.99,19.81 50.04,22.35 54.74,34.67 29.21,39.88 24.38,39.88 18.41,41.91 67.06,11.18 67.06,22.1 64.52,40.64 54.23,9.4 35.05,21.34
  pour Bottom (isolate 0.381, rank 2): 64.26,52.58 65.28,51.56 65.28,39.88 67.82,37.34 67.82,5.71 65.02,3.05 65.02,0.51 28.45,0.1 -1.04,0.61 -1.04,54.25 64.26,54.25
  pour Top (isolate 0.381, rank 2): 64.14,53.72 65.41,51.44 65.41,39.88 67.82,37.47 67.82,5.84 65.15,3.17 65.15,-0.99 -0.46,-0.99 -0.46,52.73 4.78,53.75
  pour Top (isolate 0.305, no thermals): 20.19,11.56 21.46,11.56 21.46,5.97 20.7,5.21 20.19,5.21
GNDA
  Top 0.305: IC4.7 22.73,8.01 24,6.73
  Top 0.406: 24,6.73 NM1.2 24,6.22
  pour Top (isolate 0.305, no thermals): 22.99,7.75 22.99,5.59 22.35,4.95 22.35,1.91 22.61,1.65 24.13,1.65 24.38,2.03 24.26,6.48
INT
  Top 0.254: IC1(2).13 43.69,30.48 43.56,30.61 43.56,31.32 IC1(1).13
  Top 0.305: IC1(1).13 43.54,42.06 39.12,46.48 J1.2
LL
  Top 0.305: IC2.7 30.61,28 | 30.61,28 29.52,28 29.46,27.94 27.62,27.94 RN1.2 | IC2.6 30.55,28.64 30.61,28.57 30.61,28
MISO  (via drill 0.6)
  Top 0.254: IC1(2).16 42.19,29.69 41.15,30.73 IC1(1).16
  Top 0.305: IC1(1).16 41.14,35.69 v40.64,36.2 40.26,36.58 40.26,41.91 33.53,48.64 32,48.64 31.5,49.15 J1.5
  Bottom 0.305: ICSP.1 61.72,32.38 61.72,36.58 59.18,39.12 46.99,39.12 44.07,36.2 v40.64,36.2
MOSI  (via drill 0.6)
  Top 0.254: IC1(2).15 42.69,29.95 42.04,30.61 42.04,31.25 IC1(1).15
  Top 0.305: IC1(1).15 41.94,37.31 v41.53,37.72 41.53,41.78 34.04,49.28 J1.4
  Bottom 0.305: ICSP.4 67.56,29.34 67.56,31.24 66.8,32 63.25,32 62.48,32.77 62.48,36.96 59.56,39.88 46.61,39.88 44.45,37.72 v41.53,37.72
N$1
  Top 0.305: R6.2 24,4.06 25.65,2.41 R3.1
N$2  (via drill 0.6)
  Top 0.406: RN1.7 25.04,27.92 24.53,28.43 v22.99,28.45 | L.A 5.5,22.57 5.21,22.86 v2.03,22.86
  Bottom 0.406: v2.03,22.86 2.03,23.62 3.3,24.89 3.3,26.42 4.32,27.43 4.32,29.21 5.46,30.35 7.11,30.35 8.13,31.37 19.18,31.37 21.21,29.34 22.1,29.34 v22.99,28.45
N$3  (via drill 0.6)
  Top 0.406: RN1.6 25.52,28.72 25.01,29.24 25.01,30.62 23.75,31.88 23.75,32.51 22.61,33.53 v21.84,33.53 | TX.C 2.41,24.13 2.03,24.51 v2.03,25.4
  Bottom 0.406: v21.84,33.53 20.45,33.53 19.18,32.26 7.87,32.26 6.86,31.24 5.08,31.24 3.43,29.59 3.43,27.94 2.03,26.54 v2.03,25.4
N$4  (via drill 0.6)
  Top 0.406: RN1.5 26.25,30.65 24.64,32.26 24.64,32.89 22.73,34.8 v20.45,34.8 | RX.C 2.29,26.67 2.03,26.92 v2.03,28.32
  Bottom 0.406: v2.03,28.32 2.03,29.46 4.7,32.13 6.6,32.13 7.62,33.15 18.8,33.15 v20.45,34.8
N$5  (via drill 0.6)
  Top 0.406: v26.16,15.75 26.25,15.96 RN2.8 26.25,17.91 25.4,17.91 25.4,18.67 25.4,18.78 RN2.7 | v6.99,16.51 +3.3V.A
  Bottom 0.406: v26.16,15.75 25.02,16.89 25.02,17.4 23.88,18.54 18.03,18.54 16,16.51 12.57,16.51 12.19,16.13 8.76,16.13 8.38,16.51 v6.99,16.51
N$6  (via drill 0.6)
  Top 0.305: IC2.2 IC2.1 33.57,27.34 v33.27,27.05 | v29.08,29.21 28.57,28.7 27.62,28.7 RN1.3
  Bottom 0.305: v33.27,27.05 31.24,27.05 v29.08,29.21
N$7  (via drill 0.6)
  Top 0.406: v21.21,27.94 22.03,27.25 24.57,27.25 24.7,27.12 RN1.8 | PG.A 5.5,20.03 5.21,20.32 v2.03,20.32
  Bottom 0.406: v2.03,20.32 2.03,21.08 3.3,22.35 3.3,23.5 4.19,24.38 4.19,25.91 5.21,26.92 5.21,28.83 5.84,29.46 7.37,29.46 8.38,30.48 18.67,30.48 v21.21,27.94
N$8  (via drill 0.6)
  Top 0.305: IC3.2 IC3.1 34.25,18.2 34.16,18.16 v33.4,18.16 | RN1.4 27.6,30.52 28.07,30.99 v29.08,30.99
  Bottom 0.305: v33.4,18.16 34.16,18.92 34.16,25.91 34.54,26.29 34.54,27.56 33.91,28.19 31.88,28.19 v29.08,30.99
N$9
  Top 1.27: L2.1 9.27,5.69 T2.1
N$10
  Top 0.254: 41.53,26.8 42.42,26.8
N$11  (via drill 0.6)
  Top 0.254: IC1(2).1 46.58,25.3 47.75,24.13 48.11,24.13 IC1(1).1
  Top 0.305: J3.4 55.88,48.9 51.18,44.2 v51.18,33.78 | v48.26,22.86 48.26,24.23 IC1(1).1
  Bottom 0.305: v48.26,22.86 47.37,23.75 47.37,33.15 48.9,34.67 50.29,34.67 v51.18,33.78
N$12  (via drill 0.6)
  Top 0.254: IC1(2).2 46.84,25.8 47.62,25.02 48.2,25.02 IC1(1).2
  Top 0.305: J3.5 53.34,49.28 49.4,45.34 v49.4,33.4 | v50.04,24 49.02,25.02 48.27,25.02 IC1(1).2
  Bottom 0.305: v49.4,33.4 48.26,32.26 48.26,24.64 48.9,24 v50.04,24
N$13
  Top 0.254: IC1(2).9 45.69,29.69 46.74,30.73 IC1(1).9
  Top 0.305: IC1(1).9 46.74,38.87 47.75,39.88 47.75,42.04 47.5,42.29 47.5,46.1 50.8,49.4 J3.6
N$14
  Top 0.254: IC1(2).10 45.19,29.95 45.85,30.61 45.85,31.25 IC1(1).10
  Top 0.305: IC1(1).10 45.94,39.21 46.99,40.26 46.99,41.53 46.61,41.91 46.61,46.61 48.26,48.26 J3.7
N$15
  Top 0.254: IC4.10 22.2,9.55 22.1,9.65
  Top 0.381: 22.1,9.65 22.1,10.29
  pour Top (isolate 0.305, no thermals): 22.1,9.4 22.1,17.78 23.75,17.78 23.75,11.81 23.11,11.18 23.11,10.29 22.48,9.65 22.48,9.4
N$16
  Top 0.406: RN2.5 25.4,20.38 25.4,19.56 26.25,19.56 RN2.6
N$17  (via drill 0.6)
  Top 0.254: IC1(2).32 45.69,24.41 46.74,23.37 IC1(1).32
  Top 0.305: J3.3 58.42,48.64 52.96,43.18 v52.96,33.78 | v52.32,20.7 49.91,20.7 49.53,21.08 48.77,21.08 48.26,21.59 47.12,21.59 46.74,21.97 46.74,22.1 46.77,22.73 IC1(1).32
  Bottom 0.305: v52.96,33.78 51.94,32.77 51.94,21.08 v52.32,20.7
N$35
  Top 0.305: IC4.6 22.2,5.82 20.7,4.32 C12.1
N$39
  Top 0.305: IC4.8 23.18,8.51 24.19,7.49 24.77,7.49 NM1.1 | NM1.1 R4.2 | NM1.1 R6.1
N$47
  Top 0.254: IC4.1 19.45,9.55 19.56,9.65
  Top 0.381: 19.56,10.29 19.56,9.65
  pour Top (isolate 0.305, no thermals): 19.68,9.4 19.18,9.4 19.18,9.65 18.54,10.29 18.54,11.18 17.91,11.81 17.91,17.78 19.56,17.78 19.56,10.29 19.68,10.16
PG  (via drill 0.6)
  Top 0.254: IC4.5 19.45,7.13 v18.41,6.1
  Top 0.406: v2.03,17.78 2.03,18.8 2.29,19.05 PG.C
  Bottom 0.406: v18.41,6.1 16.89,7.62 11.81,7.62 5.71,13.72 3.3,13.72 2.03,14.99 v2.03,17.78
RESET  (via drill 0.6)
  Top 0.254: IC1(2).29 44.19,23.63 44.32,23.5 44.32,22.78 IC1(1).29
  Top 0.305: D1.A 59.77,27.94 59.56,27.81 v57.4,27.81 | 44.32,22.78 44.32,21.21 45.59,19.81 v45.59,18.92 46.61,17.91 47.69,17.91 48.39,18.61 56.39,18.61 59.05,21.34 59.05,23.88 58.42,24.51 C1.1 v57.4,27.81 | v57.4,27.81 R1.1 | RESET.3 10.51,47.03 | RESET.4 10.51,47.03 | 10.51,47.03 10.54,46.99 22.23,46.99 25.27,43.94 28.19,43.94 32.89,39.12 v32.89,38.61 | POWER.6 33.02,3.68 32.26,4.45 32.26,6.6 32.89,7.24 38.61,7.24 v39.62,6.22
  Bottom 0.305: v32.89,38.61 36.83,38.61 38.61,36.83 38.61,35.31 39.75,34.16 44.2,34.16 47.75,37.59 58.42,37.59 60.2,35.81 60.2,30.1 61.21,29.08 61.21,27.81 | 61.21,27.81 ICSP.5 | v39.62,6.22 39.62,12.95 v45.59,18.92 | 61.21,27.81 v57.4,27.81
RX  (via drill 0.6)
  Top 0.254: IC1(2).30 44.69,23.89 45.09,23.5 45.09,22.82 IC1(1).30
  Top 0.305: IC1(1).30 45.14,21.41 46.48,20.07 46.74,20.07 v47.24,19.56 | J3.1 63.5,47.88 61.72,46.1 61.72,39.24 58.67,36.2 v58.67,35.31 | IC6.4 28.81,32.88 v29.21,33.27 | IC3.3 33.59,19.5 v32.89,20.19
  Bottom 0.305: v47.24,19.56 49.02,17.78 54.23,17.78 55.12,18.67 55.63,18.67 56.77,19.81 56.77,21.59 53.47,24.89 53.47,30.1 v58.67,35.31 57.15,36.83 48.01,36.83 44.45,33.4 39.37,33.4 37.85,34.92 37.85,36.58 36.58,37.85 33.91,37.85 33.27,37.21 31.88,37.21 31.24,36.58 31.24,35.94 30.48,35.18 30.48,34.54 v29.21,33.27 27.81,31.88 27.81,28.45 28.45,27.81 29.34,27.81 30.99,26.16 32.26,26.16 33.4,25.02 33.4,20.7 v32.89,20.19
RXD
  Top 0.305: IC1.26 5.92,43.35 6.73,42.55 7.37,42.55 8.51,41.4 17.14,41.4 17.78,40.77 17.78,39.24 21.46,35.69 22.99,35.69 25.15,33.53 IC6.2
SCK/IO13  (via drill 0.6)
  Top 0.254: IC1(2).17 41.3,28.8 40.26,29.84 IC1(1).17
  Top 0.305: 30.44,29.3 IC2.5 30.39,29.3 30.48,29.34 30.48,33.78 v29.21,35.05 | IC1(1).17 39.63,29.85 39.62,29.84 39.62,35.43 39.37,35.69 39.37,37.85 v38.73,38.48 38.73,42.29 33.27,47.75 30.35,47.75 28.96,49.15 J1.6
  Bottom 0.305: ICSP.3 60.96,30.61 60.96,36.2 58.8,38.35 47.37,38.35 43.94,34.92 40.13,34.92 39.37,35.69 39.37,37.85 v38.73,38.48 37.85,39.37 33.91,39.37 33.4,39.88 32.38,39.88 31.5,38.99 31.5,38.35 30.48,37.34 30.48,36.32 v29.21,35.05
SS
  Top 0.254: IC1(2).14 43.19,30.21 42.8,30.61 42.8,31.29 IC1(1).14
  Top 0.305: IC1(1).14 42.74,41.71 36.58,47.88 J1.3
TX  (via drill 0.6)
  Top 0.254: IC1(2).31 45.19,24.15 45.85,23.5 45.85,22.85 IC1(1).31
  Top 0.305: IC1(1).31 45.94,21.62 46.74,20.83 47.88,20.83 v48.9,19.81 | J3.2 60.96,39.62 v56.64,35.31 | IC2.3 33.97,28.64 v33.27,29.34 | IC5.2 29.84,41.15 31.62,39.37 31.62,37.97 32.51,37.08 v32.51,35.94
  Bottom 0.305: v48.9,19.81 50.16,18.54 53.85,18.54 54.74,19.43 55.24,19.43 56.01,20.19 56.01,21.21 52.7,24.51 52.7,30.48 56.64,34.42 v56.64,35.31 55.88,36.07 48.26,36.07 44.83,32.64 38.99,32.64 37.08,34.54 37.08,36.32 36.32,37.08 34.42,37.08 33.27,35.94 v32.51,35.94 31.37,34.8 31.37,34.16 30.61,33.4 30.61,30.73 32,29.34 v33.27,29.34
TXD  (via drill 0.6)
  Top 0.305: IC1.6 10.41,33.27 12.57,35.43 v15.49,35.43 | IC5.4 25.29,41.8 v24.38,41.78
  Bottom 0.305: v24.38,41.78 21.84,41.78 v15.49,35.43
VIN  (via drill 0.6)
  Top 0.254: IC4.3 19.05,8.51 19.05,8.02 18.8,8.01 | IC4.4 18.8,8.01 | 18.8,8.01 18.03,7.24 16.38,7.24 | 18.41,9.14 18.8,9.14
  Top 0.305: IC4.2 18.04,9.01 18.03,9.02
  Top 0.61: POWER.1 45.72,4.45 45.21,4.95 34.67,4.95 v34.29,5.33 | v19.3,4.57 18.16,4.57 16.38,6.35 16.38,7.24 16.38,8.26 C9.1
  Bottom 0.61: v34.29,5.33 27.3,5.33 25.4,3.43 20.45,3.43 v19.3,4.57
  pour Top (isolate 0.406, no thermals): 19.68,9.14 16.13,9.14 15.11,10.16 15.11,14.1 15.88,14.1 15.88,15.62 12.7,15.62 12.7,11.43 11.81,10.54 11.05,10.54 11.05,8.64 14.61,8.64 15.37,7.87 17.65,7.87 18.8,9.02 19.68,9.02
VIND
  Top 1.27: L2.2 7.7,3.09 5.91,4.89 4.09,4.89 X1.1
  Bottom 1.27: 4.1,4.83 X1.1
WOL
  Top 0.254: IC1(2).12 44.19,30.48 44.32,30.61 44.32,31.32 IC1(1).12
  Top 0.305: IC1(1).12 44.34,42.4 41.66,45.09 J1.1
XTAL1
  Top 0.254: IC1(2).7 46.84,28.3 47.62,29.08 48.2,29.08 IC1(1).7
  Top 0.305: Y1.3 54.63,29.08 R2.1 52.04,28.92 52.1,29.05 51.31,29.84 49.91,29.84 49.15,29.08 48.27,29.08 IC1(1).7
XTAL2
  Top 0.254: IC1(2).8 46.58,28.8 47.62,29.84 IC1(1).8
  Top 0.305: IC1(1).8 48.65,29.85 49.66,30.86 R2.2 54.75,30.86 Y1.1

### Text on the board
Bottom: BT07 / 2013
tPlace: BT-V07 Rev3 | Made in Italy
tNames: 3 2 1 0 9 8 | - 6 5 4 3 2 1 0 | Digital | SCL | SDA | GND | 1 1 1 1 | AREF | TX | RX | PWM | PWM | PWM | PWM+ | PWM+ | PWM+ | Arduino | www.arduino.cc | 1 | 1 | GND | 6 7 | Analog in | 5V GND VIN | 0 1 2 3 4 5 | IOREF | RESET | 3V3 | V+
mounting: R1 | R3 | IC3 | R2 | C13 | R4 | C7 | D1